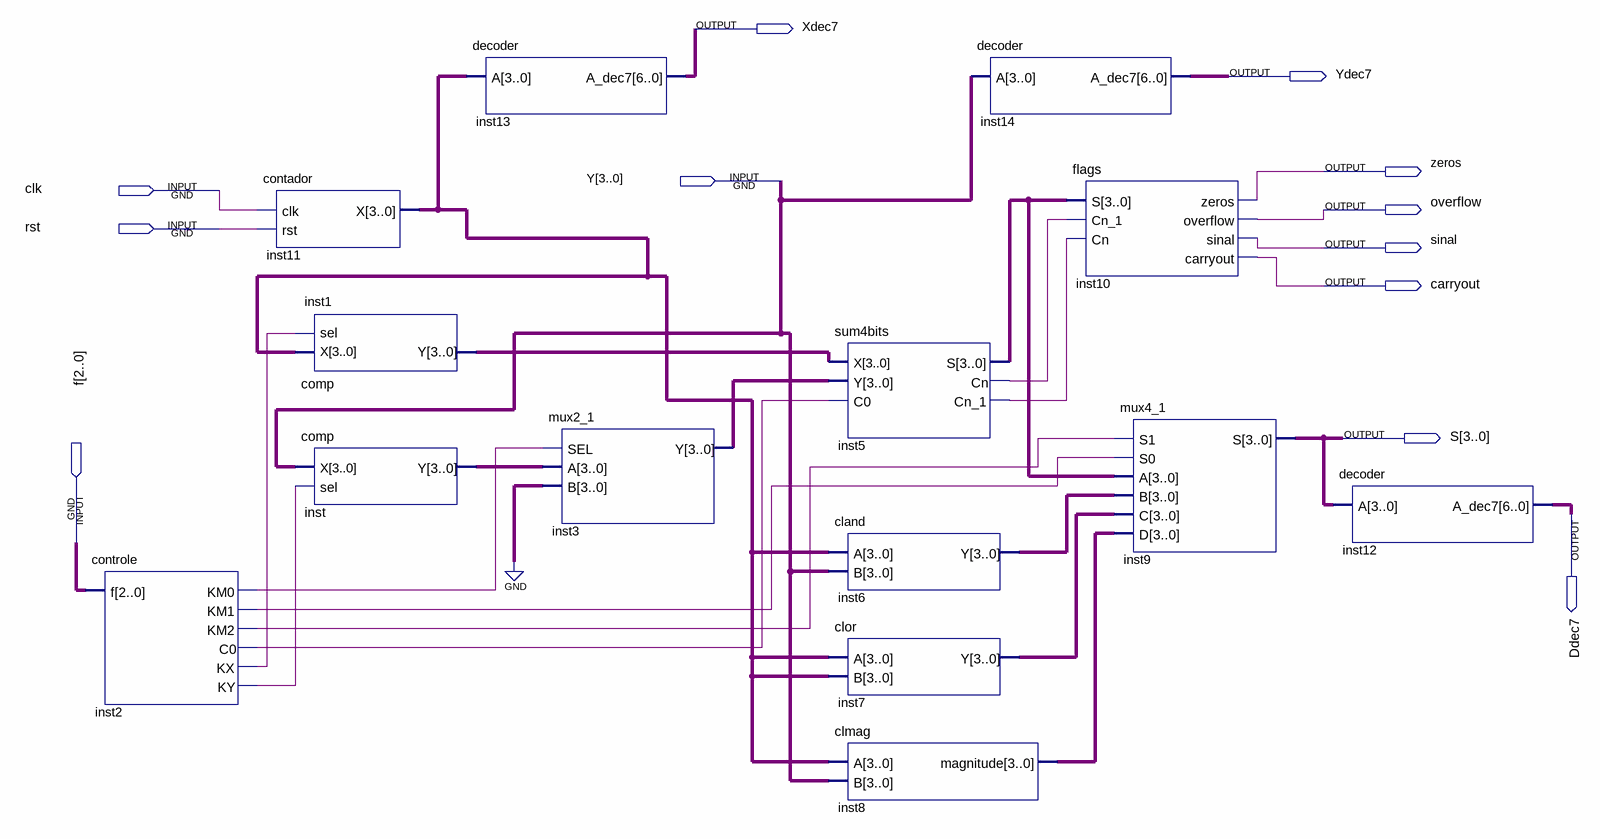
[diagram p0: schematic sheet]
// Quartus schematic esqula.bdf as structural Verilog: 14 symbols, 12 pins
module esqula (
  input  [3:0] Y,
  input  clk,
  input  rst,
  input  [2:0] f,
  output Xdec7,
  output Ydec7,
  output zeros,
  output overflow,
  output sinal,
  output carryout,
  output [3:0] S,
  output Ddec7
);

  wire inst2_c0, inst2_km0, inst2_km1, inst2_km2, inst2_kx, inst2_ky, inst5_cn, inst5_cn_1;
  wire [3:0] inst1_y, inst3_y, inst5_s, inst6_y, inst7_y, inst8_magnitude, inst11_x, inst_y;
  wire [6:0] inst12_a_dec7, inst13_a_dec7, inst14_a_dec7;

  controle inst2 (
    .f(f), .KM0(inst2_km0), .KM1(inst2_km1), .KM2(inst2_km2), .C0(inst2_c0), .KX(inst2_kx), .KY(inst2_ky));
  contador inst11 (.clk(clk), .rst(rst), .X(inst11_x));
  comp inst1 (.X(inst11_x), .sel(inst2_kx), .Y(inst1_y));
  comp inst (.X(Y), .sel(inst2_ky), .Y(inst_y));
  decoder inst13 (.A(inst11_x), .A_dec7(inst13_a_dec7));
  mux2_1 inst3 (.SEL(inst2_km0), .A(inst_y), .B(4'b0000), .Y(inst3_y));
  sum4bits inst5 (.X(inst1_y), .Y(inst3_y), .C0(inst2_c0), .S(inst5_s), .Cn(inst5_cn), .Cn_1(inst5_cn_1));
  cland inst6 (.A(inst11_x), .B(Y), .Y(inst6_y));
  clor inst7 (.A(inst11_x), .B(inst11_x), .Y(inst7_y));
  clmag inst8 (.A(inst11_x), .B(Y), .magnitude(inst8_magnitude));
  decoder inst14 (.A(Y), .A_dec7(inst14_a_dec7));
  flags inst10 (
    .S(inst5_s), .Cn_1(inst5_cn), .Cn(inst5_cn_1), .zeros(zeros), .overflow(overflow), .sinal(sinal),
    .carryout(carryout));
  mux4_1 inst9 (.S1(inst2_km2), .S0(inst2_km1), .A(inst5_s), .B(inst6_y), .C(inst7_y), .D(inst8_magnitude), .S(S));
  decoder inst12 (.A(S), .A_dec7(inst12_a_dec7));
endmodule
